# EAGLE design GPS breakout (EAGLE 6.5.0)
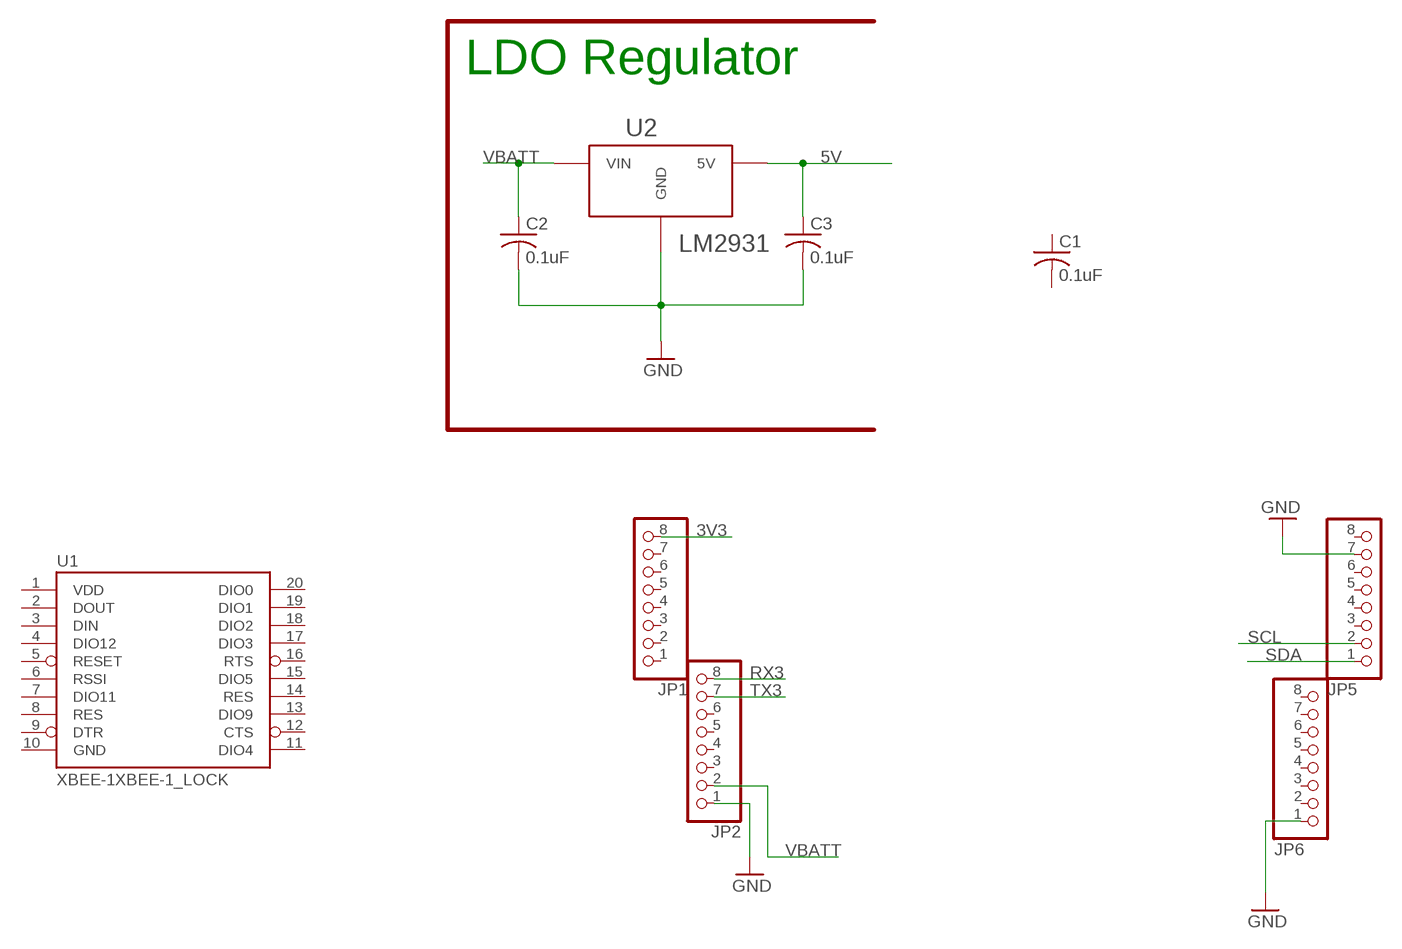
[diagram p0: schematic, sheet 1]

## Parts
C1  0.1uF  C-USC0603  [C0603]
C2  0.1uF  C-USC0603  [C0603]
C3  0.1uF  C-USC0603  [C0603]
JP1  PINHD-1X81X08_NO_SILK_LOCK  [1X08_NO_SS_LOCKING]
JP2  PINHD-1X81X08_NO_SILK_LOCK  [1X08_NO_SS_LOCKING]
JP5  PINHD-1X81X08_NO_SILK_LOCK  [1X08_NO_SS_LOCKING]
JP6  PINHD-1X81X08_NO_SILK_LOCK  [1X08_NO_SS_LOCKING]
U1  XBEE-1XBEE-1_LOCK  [XBEE-1_LOCK]
U2  LM2931  [TO263]

## Nets
3V3 [3.3V]: JP1.8
5V: C3.1 U2.P$3(5V)
GND: C2.2 C3.2 JP2.1 JP5.7 JP6.1 U2.P$1(GND)
RX3: JP2.8
SCL [I/O]: JP5.2
SDA [I/O]: JP5.1
TX3: JP2.7
VBATT: C2.1 JP2.2 U2.P$2(VIN)
Unconnected: C1.1 C1.2 JP1.1 JP1.2 JP1.3 JP1.4 JP1.5 JP1.6 JP1.7 JP2.3 JP2.4 JP2.5 JP2.6 JP5.3 JP5.4 JP5.5 JP5.6 JP5.8 JP6.2 JP6.3 JP6.4 JP6.5 JP6.6 JP6.7 JP6.8 U1.2(DOUT) U1.3(DIN) U1.4(DIO12) U1.5(RESET) U1.6(RSSI) U1.7(DIO11) U1.8(RES) U1.9(DTR) U1.11(DIO4) U1.12(CTS) U1.13(DIO9) U1.14(RES) U1.15(DIO5) U1.16(RTS) U1.17(DIO3) U1.18(DIO2) U1.19(DIO1) U1.20(DIO0)

## Notes on the sheet
- LDO Regulator

## Power pins joined to a net without a drawn wire
GND: U1.10(GND)
VDD: U1.1(VDD)

## Library data of the parts
C1-C3 = resistor:C-US: CAPACITOR, American symbol
JP1 JP2 JP5 JP6 = pinhead:PINHD-1X8: PIN HEADER
U1 = SparkFun-RF:XBEE-1: Xbee module footprints SMT header is CONN-09042.
U2 = on-semiconductor:LM2931; COST: 0.53

## Board
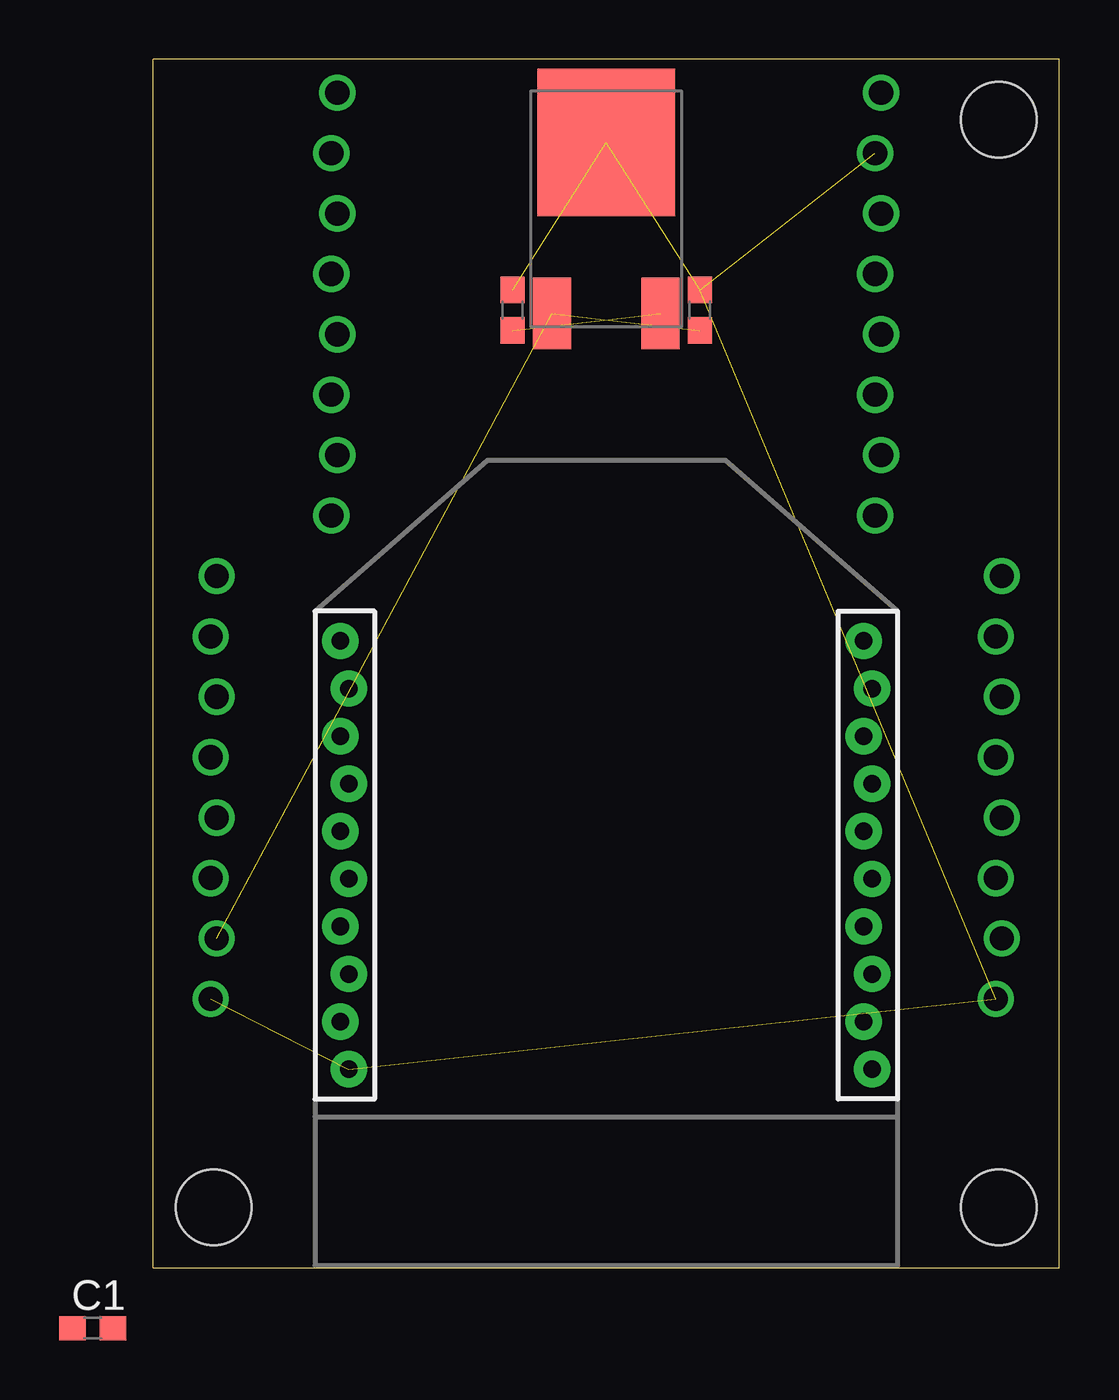
[diagram p1: board, top side]

Size 38.1 x 50.8 mm. Coordinates in mm from the lower left corner, seen from the top.
Outline: 0,0 38.1,0 38.1,50.8 0,50.8 0,0
Copper layers (1*16): Top 0.0356mm / dielectric 1.5011mm / Bottom 0.0356mm
Design rules "LaenPCBOrder": minimum track width 6mil, minimum drill 13mil, track to track 6mil, track to pad 6mil, pad to pad 6mil, via to via 6mil, smd to smd 6mil, copper to edge 15mil, drill to drill 6mil, minimum pad ring 7mil, minimum via ring 7mil, stop-mask expansion 4mil, vias tented up to drill 0mil, thermal gap 10mil
Holes 3.17 mm at 35.56,48.26 35.56,2.54 2.54,2.54

### Footprints (pad centres in the part's own frame; a part is rotated, then mirrored left to right if it is on the bottom)
C0603 = smd 1.1 x 1: 1 -0.85,0; 2 0.85,0
1X08_NO_SS_LOCKING = drill 1.016: 1 -8.89,0.127; 2 -6.35,-0.127; 3 -3.81,0.127; 4 -1.27,-0.127; 5 1.27,0.127; 6 3.81,-0.127; 7 6.35,0.127; 8 8.89,-0.127
XBEE-1_LOCK = drill 0.737 pad 1.524: 1 -11.178,20; 2 -10.822,18; 3 -11.178,16; 4 -10.822,14; 5 -11.178,12; 6 -10.822,10; 7 -11.178,8; 8 -10.822,6; 9 -11.178,4; 10 -10.822,2; 11 11.178,2; 12 10.822,4; 13 11.178,6; 14 10.822,8; 15 11.178,10; 16 10.822,12; 17 11.178,14; 18 10.822,16; 19 11.178,18; 20 10.822,20
TO263 = smd 5.791 x 6.198: P$1 0,2.794 | smd 1.6 x 2.997: P$2 -2.286,-4.394; P$3 2.286,-4.394

### Placement (x,y rotation side)
C1  -2.54,-2.54 0 top
C2  22.99,40.26 90 top
C3  15.11,40.26 90 top
JP1  7.62,40.51 90 top
JP2  2.54,20.19 90 top
JP5  30.48,40.51 90 top
JP6  35.56,20.19 90 top
U1  19.05,6.35 0 top
U2  19.05,44.51 0 top

### Tracks (layer width: path | path; a pad name or v marks a point on that pad's centre or on a via)
5V  (1 unrouted)
GND  (6 unrouted)
SCL
  Top 0.203: 30.48,34.16 JP5.2
VBATT  (2 unrouted)